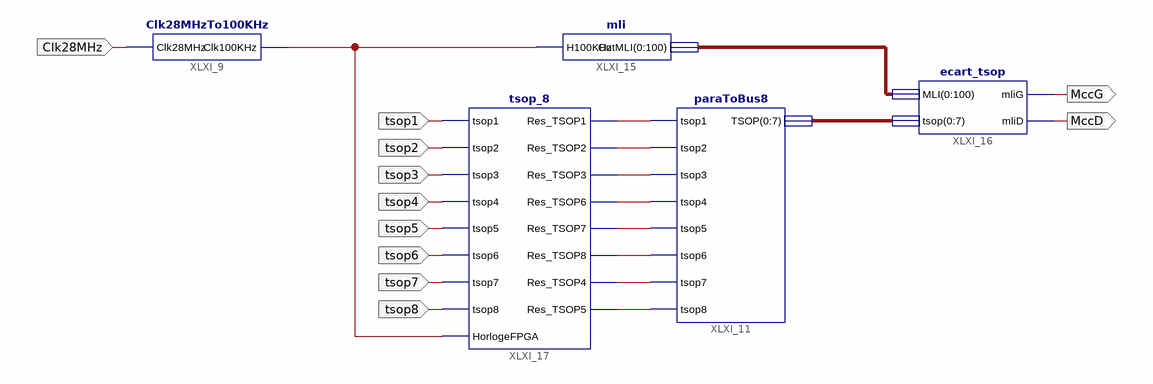
[diagram p0: schematic sheet 1]
// Xilinx ISE schematic robot.sch (spartan3a) as structural Verilog: 5 symbols, 11 ports
module robot (
  input  tsop1,
  input  tsop2,
  input  tsop3,
  input  tsop4,
  input  tsop5,
  input  tsop6,
  input  tsop7,
  input  tsop8,
  input  Clk28MHz,
  output MccG,
  output MccD
);

  wire H100KHz, XLXN_39, XLXN_40, XLXN_41, XLXN_42, XLXN_43, XLXN_44, XLXN_45, XLXN_46;
  wire [7:0] XLXN_38;
  wire [100:0] XLXN_59;

  paraToBus8 XLXI_11 (
    .tsop1(XLXN_39), .tsop2(XLXN_40), .tsop3(XLXN_41), .tsop4(XLXN_42), .tsop5(XLXN_43), .tsop6(XLXN_44),
    .tsop7(XLXN_45), .tsop8(XLXN_46),
    .TSOP({XLXN_38[0], XLXN_38[1], XLXN_38[2], XLXN_38[3], XLXN_38[4], XLXN_38[5], XLXN_38[6], XLXN_38[7]}));
  mli XLXI_15 (
    .H100KHz(H100KHz),
    .OutMLI({XLXN_59[0], XLXN_59[1], XLXN_59[2], XLXN_59[3], XLXN_59[4], XLXN_59[5], XLXN_59[6], XLXN_59[7], XLXN_59[8], XLXN_59[9], XLXN_59[10], XLXN_59[11], XLXN_59[12], XLXN_59[13], XLXN_59[14], XLXN_59[15], XLXN_59[16], XLXN_59[17], XLXN_59[18], XLXN_59[19], XLXN_59[20], XLXN_59[21], XLXN_59[22], XLXN_59[23], XLXN_59[24], XLXN_59[25], XLXN_59[26], XLXN_59[27], XLXN_59[28], XLXN_59[29], XLXN_59[30], XLXN_59[31], XLXN_59[32], XLXN_59[33], XLXN_59[34], XLXN_59[35], XLXN_59[36], XLXN_59[37], XLXN_59[38], XLXN_59[39], XLXN_59[40], XLXN_59[41], XLXN_59[42], XLXN_59[43], XLXN_59[44], XLXN_59[45], XLXN_59[46], XLXN_59[47], XLXN_59[48], XLXN_59[49], XLXN_59[50], XLXN_59[51], XLXN_59[52], XLXN_59[53], XLXN_59[54], XLXN_59[55], XLXN_59[56], XLXN_59[57], XLXN_59[58], XLXN_59[59], XLXN_59[60], XLXN_59[61], XLXN_59[62], XLXN_59[63], XLXN_59[64], XLXN_59[65], XLXN_59[66], XLXN_59[67], XLXN_59[68], XLXN_59[69], XLXN_59[70], XLXN_59[71], XLXN_59[72], XLXN_59[73], XLXN_59[74], XLXN_59[75], XLXN_59[76], XLXN_59[77], XLXN_59[78], XLXN_59[79], XLXN_59[80], XLXN_59[81], XLXN_59[82], XLXN_59[83], XLXN_59[84], XLXN_59[85], XLXN_59[86], XLXN_59[87], XLXN_59[88], XLXN_59[89], XLXN_59[90], XLXN_59[91], XLXN_59[92], XLXN_59[93], XLXN_59[94], XLXN_59[95], XLXN_59[96], XLXN_59[97], XLXN_59[98], XLXN_59[99], XLXN_59[100]}));
  ecart_tsop XLXI_16 (
    .mliG(MccG), .mliD(MccD),
    .MLI({XLXN_59[0], XLXN_59[1], XLXN_59[2], XLXN_59[3], XLXN_59[4], XLXN_59[5], XLXN_59[6], XLXN_59[7], XLXN_59[8], XLXN_59[9], XLXN_59[10], XLXN_59[11], XLXN_59[12], XLXN_59[13], XLXN_59[14], XLXN_59[15], XLXN_59[16], XLXN_59[17], XLXN_59[18], XLXN_59[19], XLXN_59[20], XLXN_59[21], XLXN_59[22], XLXN_59[23], XLXN_59[24], XLXN_59[25], XLXN_59[26], XLXN_59[27], XLXN_59[28], XLXN_59[29], XLXN_59[30], XLXN_59[31], XLXN_59[32], XLXN_59[33], XLXN_59[34], XLXN_59[35], XLXN_59[36], XLXN_59[37], XLXN_59[38], XLXN_59[39], XLXN_59[40], XLXN_59[41], XLXN_59[42], XLXN_59[43], XLXN_59[44], XLXN_59[45], XLXN_59[46], XLXN_59[47], XLXN_59[48], XLXN_59[49], XLXN_59[50], XLXN_59[51], XLXN_59[52], XLXN_59[53], XLXN_59[54], XLXN_59[55], XLXN_59[56], XLXN_59[57], XLXN_59[58], XLXN_59[59], XLXN_59[60], XLXN_59[61], XLXN_59[62], XLXN_59[63], XLXN_59[64], XLXN_59[65], XLXN_59[66], XLXN_59[67], XLXN_59[68], XLXN_59[69], XLXN_59[70], XLXN_59[71], XLXN_59[72], XLXN_59[73], XLXN_59[74], XLXN_59[75], XLXN_59[76], XLXN_59[77], XLXN_59[78], XLXN_59[79], XLXN_59[80], XLXN_59[81], XLXN_59[82], XLXN_59[83], XLXN_59[84], XLXN_59[85], XLXN_59[86], XLXN_59[87], XLXN_59[88], XLXN_59[89], XLXN_59[90], XLXN_59[91], XLXN_59[92], XLXN_59[93], XLXN_59[94], XLXN_59[95], XLXN_59[96], XLXN_59[97], XLXN_59[98], XLXN_59[99], XLXN_59[100]}),
    .tsop({XLXN_38[0], XLXN_38[1], XLXN_38[2], XLXN_38[3], XLXN_38[4], XLXN_38[5], XLXN_38[6], XLXN_38[7]}));
  tsop_8 XLXI_17 (
    .tsop1(tsop1), .tsop2(tsop2), .tsop3(tsop3), .tsop4(tsop4), .tsop5(tsop5), .tsop6(tsop6), .tsop7(tsop7),
    .tsop8(tsop8), .HorlogeFPGA(H100KHz), .Res_TSOP1(XLXN_39), .Res_TSOP2(XLXN_40), .Res_TSOP3(XLXN_41),
    .Res_TSOP6(XLXN_42), .Res_TSOP7(XLXN_43), .Res_TSOP8(XLXN_44), .Res_TSOP4(XLXN_45), .Res_TSOP5(XLXN_46));
  Clk28MHzTo100KHz XLXI_9 (.Clk28MHz(Clk28MHz), .Clk100KHz(H100KHz));
endmodule
